# EAGLE design Esquematico (EAGLE 7.4.0)
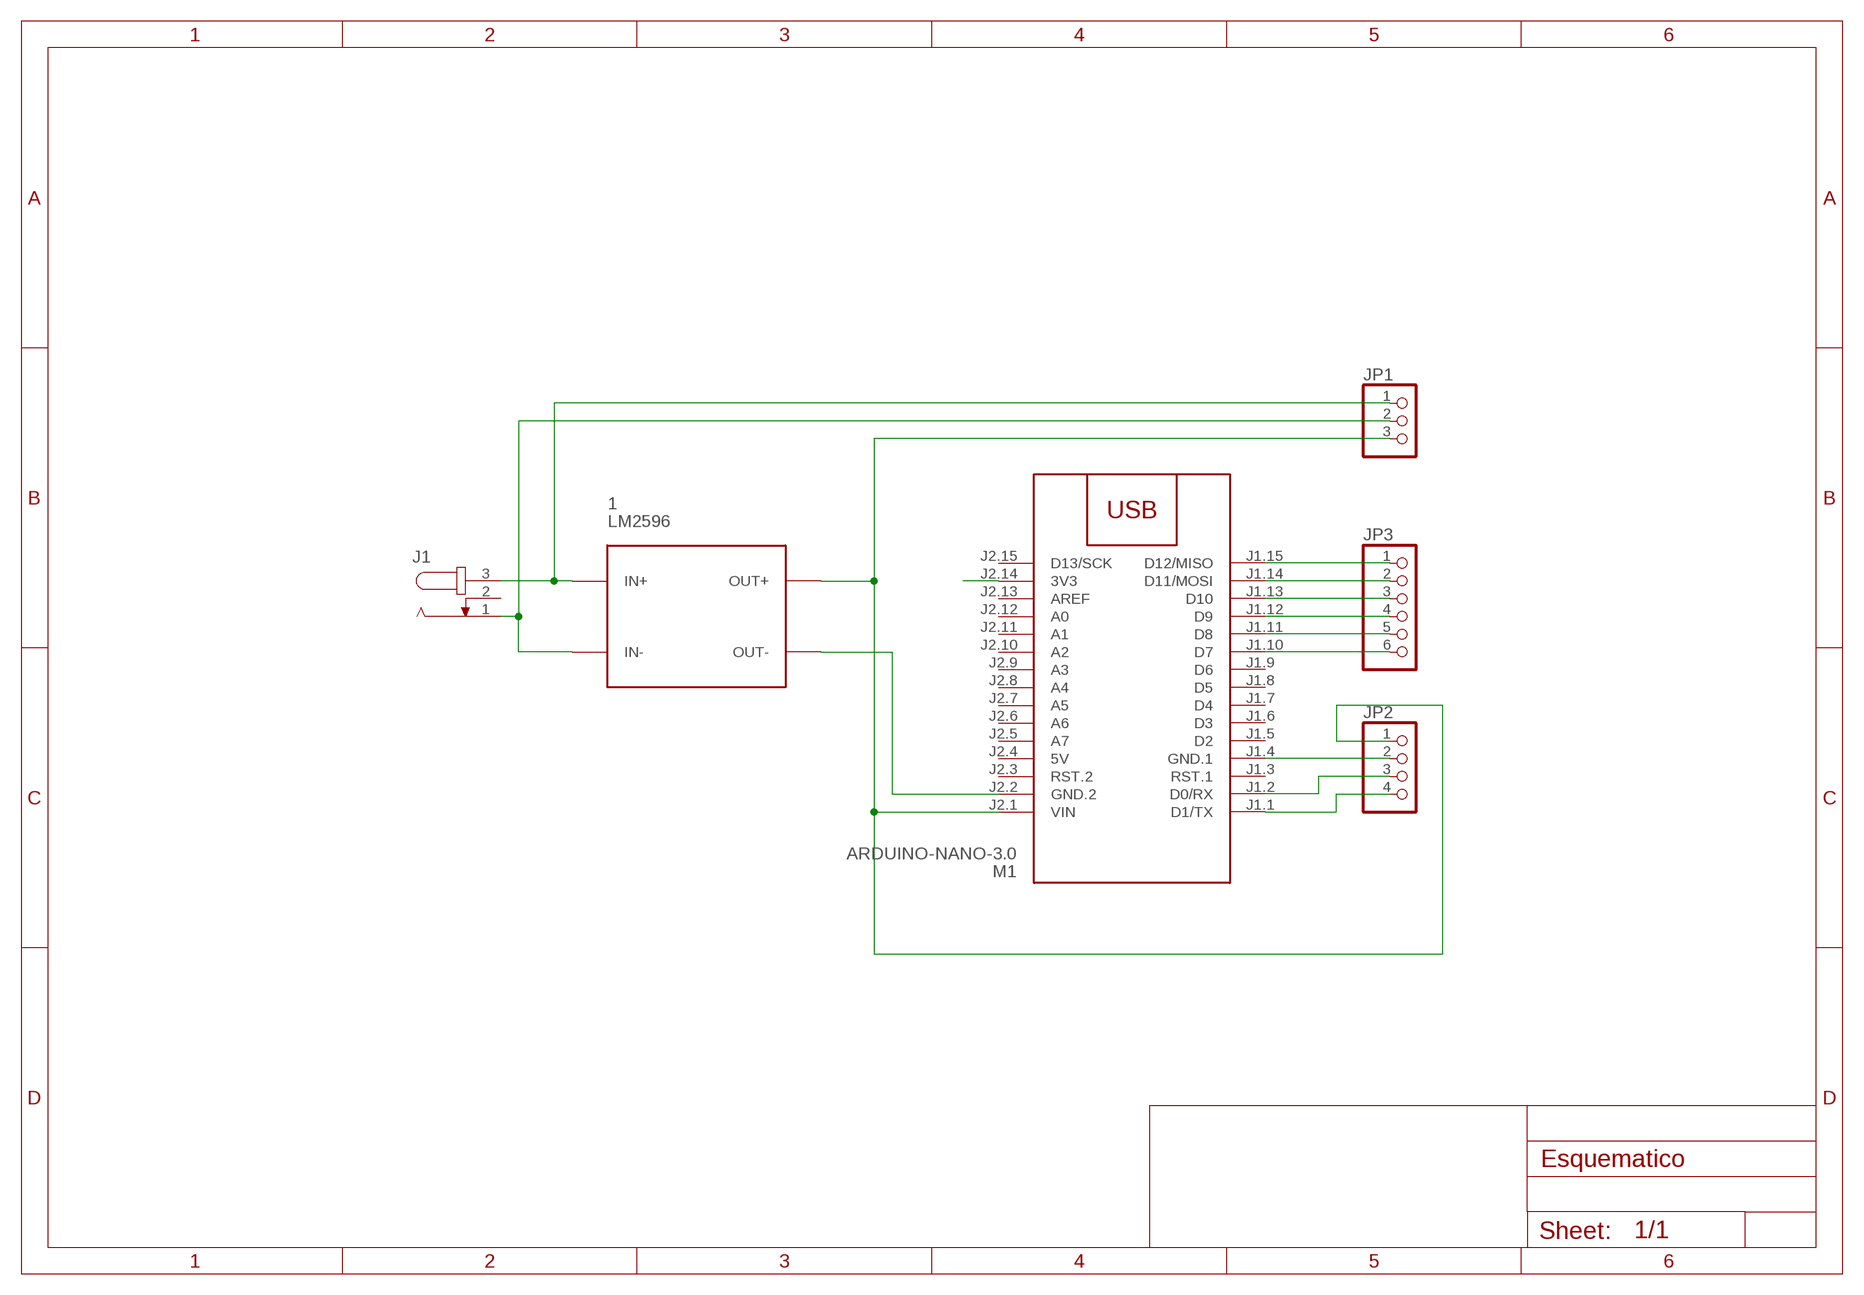
[diagram p0: schematic, sheet 1]

## Parts
1  LM2596  DC-DC-STEP-DOWN-LM2596  [DC-DC-STEP-DOWN-LM2596]
J1  JACK-PLUG0  [SPC4077]
JP1  PINHD-1X3  [1X03]
JP2  PINHD-1X4  [1X04]
JP3  PINHD-1X6  [1X06]
M1  ARDUINO-NANO-3.0  [ARDUINO-NANO-3.0]

## Nets
N$1: M1.J2.14(3V3)
N$2: 1.IN- J1.1 JP1.2
N$4: 1.OUT+ JP1.3 JP2.1 M1.J2.1(VIN)
N$5: JP3.1 M1.J1.15(D12/MISO)
N$6: JP3.2 M1.J1.14(D11/MOSI)
N$7: JP3.3 M1.J1.13(D10)
N$8: JP3.4 M1.J1.12(D9)
N$9: JP3.5 M1.J1.11(D8)
N$10: JP3.6 M1.J1.10(D7)
N$11: JP2.2 M1.J1.4(GND.1)
N$12: JP2.4 M1.J1.1(D1/TX)
N$13: JP2.3 M1.J1.2(D0/RX)
N$14: 1.OUT- M1.J2.2(GND.2)
N$15: 1.IN+ J1.3 JP1.1
Unconnected: J1.2 M1.J1.3(RST.1) M1.J1.5(D2) M1.J1.6(D3) M1.J1.7(D4) M1.J1.8(D5) M1.J1.9(D6) M1.J2.3(RST.2) M1.J2.5(A7) M1.J2.6(A6) M1.J2.7(A5) M1.J2.8(A4) M1.J2.9(A3) M1.J2.10(A2) M1.J2.11(A1) M1.J2.12(A0) M1.J2.13(AREF) M1.J2.15(D13/SCK)

## Power pins joined to a net without a drawn wire
5V: M1.J2.4(5V)

## Library data of the parts
1 = diy-modules:DC-DC-STEP-DOWN-LM2596: DC/DC Step-Down Regulator based on LM2596-ADJ chip
J1 = con-jack:JACK-PLUG: DC POWER JACK Power Jack, DC, Right Angle, Through Hole, Rated 5A at 16VDC, PC Terminals Distributor: Farnell (www.Farnell.de) Drawing: 84N1161.pdf / 84N1162.pdf Manufacturer: SPC Technology (www.spctechnology.com) Type: SPC4077 / SPC 4078; OC_FARNELL: unknown; OC_NEWARK: unknown
JP1 = pinhead:PINHD-1X3: PIN HEADER
JP2 = pinhead:PINHD-1X4: PIN HEADER
JP3 = pinhead:PINHD-1X6: PIN HEADER
M1 = diy-modules:ARDUINO-NANO-3.0: Arduino Nano 3.0

## Board
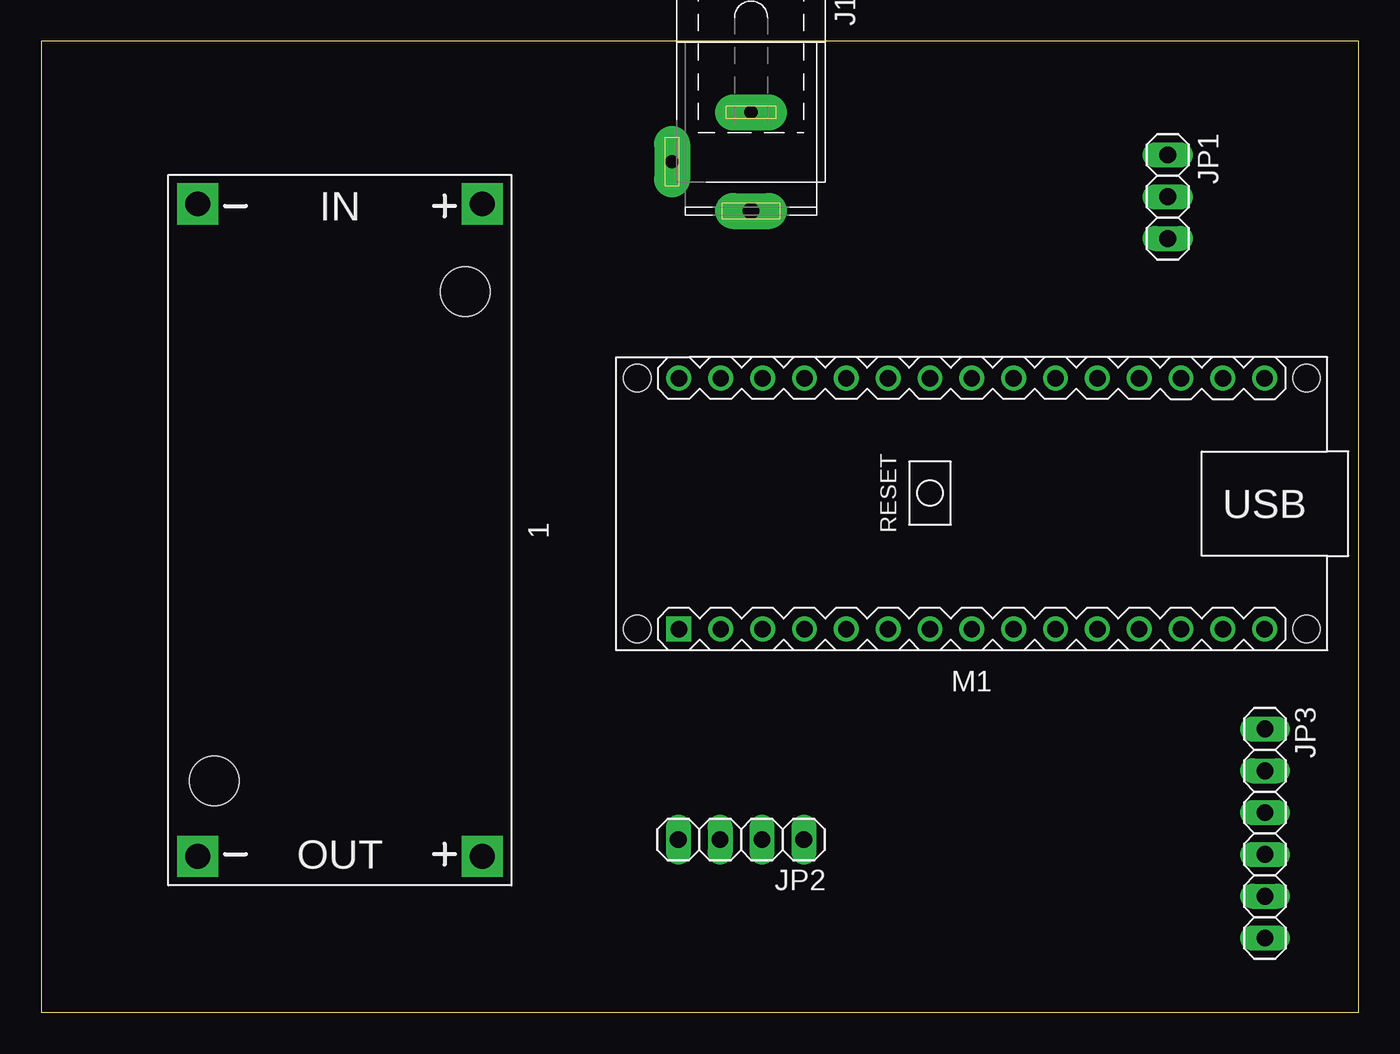
[diagram p1: board, top side]
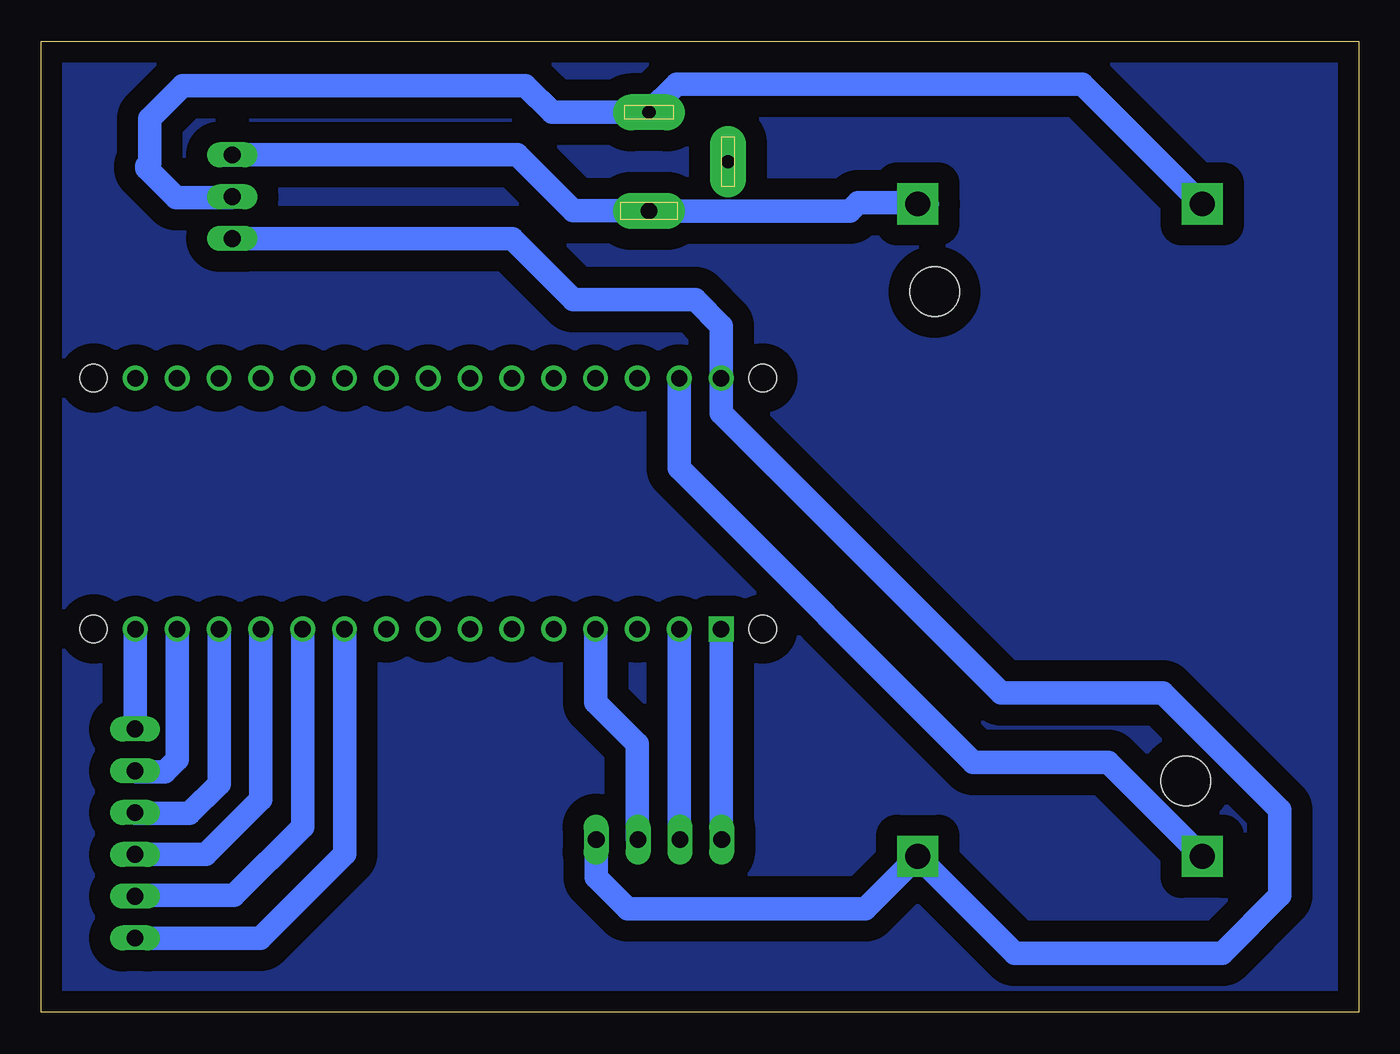
[diagram p2: board, bottom side, seen from below]

Size 80 x 59 mm. Coordinates in mm from the lower left corner, seen from the top.
Outline: 0,0 80,0 80,59 0,59 0,0
Copper layers (1*16): Top 0.035mm / dielectric 1.5mm / Bottom 0.035mm
Design rules "default": minimum track width 10mil, minimum drill 24mil, track to track 8mil, track to pad 8mil, pad to pad 8mil, via to via 8mil, smd to smd 8mil, copper to edge 40mil, drill to drill 8mil, minimum pad ring 10mil, minimum via ring 8mil, stop-mask expansion 4mil, vias tented up to drill 0mil, thermal gap 10mil

### Footprints (pad centres in the part's own frame; a part is rotated, then mirrored left to right if it is on the bottom)
DC-DC-STEP-DOWN-LM2596 = drill 1.5 pad 2.5 square: IN+ -19.812,8.636; IN- -19.812,-8.636; OUT+ 19.812,8.636; OUT- 19.812,-8.636 | hole 3: -14.478,7.62; 15.24,-7.62
SPC4077 = drill 0.8 pad 2.184 long: 1 -3,0; 2 0,-4.8 | drill 1 pad 2.184 long: 3 3,0
1X03 = drill 1.016 long: 1 -2.54,0; 2 0,0; 3 2.54,0
1X04 = drill 1.016 long: 1 -3.81,0; 2 -1.27,0; 3 1.27,0; 4 3.81,0
1X06 = drill 1.016 long: 1 -6.35,0; 2 -3.81,0; 3 -1.27,0; 4 1.27,0; 5 3.81,0; 6 6.35,0
ARDUINO-NANO-3.0 = drill 1 square: J1.1 17.78,7.62 | drill 1: J1.2 15.24,7.62; J1.3 12.7,7.62; J1.4 10.16,7.62; J1.5 7.62,7.62; J1.6 5.08,7.62; J1.7 2.54,7.62; J1.8 0,7.62; J1.9 -2.54,7.62; J1.10 -5.08,7.62; J1.11 -7.62,7.62; J1.12 -10.16,7.62; J1.13 -12.7,7.62; J1.14 -15.24,7.62; J1.15 -17.78,7.62; J2.1 17.78,-7.62; J2.2 15.24,-7.62; J2.3 12.7,-7.62; J2.4 10.16,-7.62; J2.5 7.62,-7.62; J2.6 5.08,-7.62; J2.7 2.54,-7.62; J2.8 0,-7.62; J2.9 -2.54,-7.62; J2.10 -5.08,-7.62; J2.11 -7.62,-7.62; J2.12 -10.16,-7.62; J2.13 -12.7,-7.62; J2.14 -15.24,-7.62; J2.15 -17.78,-7.62 | hole 1.651: -20.32,7.62; -20.32,-7.62; 20.32,-7.62; 20.32,7.62

### Placement (x,y rotation side)
1  18.14,29.3 270 top
J1  43.1,51.68 270 top
JP1  68.4,49.55 270 top
JP2  42.49,10.5 180 top
JP3  74.3,10.87 270 top
M1  56.5,30.91 180 top

### Tracks (layer width: path | path; a pad name or v marks a point on that pad's centre or on a via)
N$2
  Bottom 1.422: 1.IN- 16.79,56.4 41.4,56.4 43.1,54.7 J1.1 48.98,54.68 50.6,56.3 71.4,56.3 73.4,54.3 73.4,51.6 73.6,51.4 73.6,51.3 71.8,49.5 68.45,49.5 JP1.2
N$3
  pour Bottom (isolate 1.27): 0,59 80,59 80,0 0,0
N$4
  Bottom 1.422: JP2.1 46.3,8.2 44.4,6.3 29.96,6.3 1.OUT+ 20.89,3.6 8.3,3.6 4.8,7.1 4.8,12.3 11.9,19.4 21.7,19.4 38.72,36.42 M1.J2.1 38.7,38.55 38.7,41.7 40.3,43.3 47.7,43.3 51.41,47.01 JP1.3
N$5
  Bottom 1.422: M1.J1.15 74.28,17.24 JP3.1
N$6
  Bottom 1.422: M1.J1.14 71.74,15.36 72.5,14.6 74.22,14.6 JP3.2
N$7
  Bottom 1.422: M1.J1.13 69.2,13.9 71,12.1 74.26,12.1 JP3.3
N$8
  Bottom 1.422: M1.J1.12 66.66,12.94 70,9.6 JP3.4
N$9
  Bottom 1.422: M1.J1.11 64.12,11.28 68.3,7.1 74.26,7.1 JP3.5
N$10
  Bottom 1.422: M1.J1.10 61.58,9.62 66.7,4.5 74.28,4.5 JP3.6
N$11
  Bottom 1.422: M1.J1.4 46.34,18.84 43.8,16.3 43.8,10.54 JP2.2
N$12
  Bottom 1.422: M1.J1.1 38.72,11.02 38.7,11 38.7,10.52 JP2.4
N$13
  Bottom 1.422: M1.J1.2 41.26,10.54 JP2.3
N$14
  Bottom 1.422: M1.J2.2 41.26,33.06 23.4,15.2 15.22,15.2 1.OUT-
N$15
  Bottom 1.422: 1.IN+ 26.76,49.1 26.2,49.1 26.3,49.2 30.4,49.2 30.92,48.68 J1.3 43.12,48.7 47.7,48.7 51.09,52.09 JP1.1